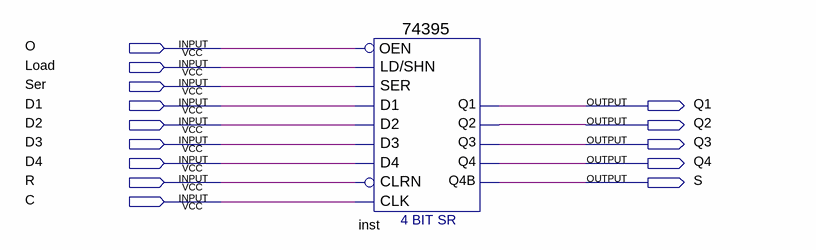
[diagram p0: schematic sheet]
// Quartus schematic 74395_universal_register.bdf as structural Verilog: 1 symbols, 14 pins
module \74395_universal_register  (
  input  O,
  input  Load,
  input  Ser,
  input  D1,
  input  D2,
  input  D3,
  input  D4,
  input  R,
  input  C,
  output Q1,
  output Q2,
  output Q3,
  output Q4,
  output S
);

  \74395  inst (
    .\LD/SHN (Load), .SER(Ser), .D1(D1), .D2(D2), .D3(D3), .CLRN(R), .CLK(C), .D4(D4), .OEN(O), .Q4(Q4),
    .Q4B(S), .Q1(Q1), .Q2(Q2), .Q3(Q3));
endmodule
